# Altium schematic sheet 8.2 CC&CP.SchDoc: 6.6kW Daul OBC +11kW WPT
size A3; Date: 2022/11/13; Revision: V 1.0; SheetNumber: 10; SheetTotal: 14; PageSetup: Record=PageOptions|CenterHorizontal=True|CenterVertical=True|PrintScale=0.37|XCorrection=1.00|YCorrection=1.00|PrintKind=2|BorderSize=5000000|LeftOffset=0|BottomOffset=0|Orientation=2|PaperLength=1000|PaperWidth=1000|Scale=100|PaperSource=7|PrintQuality=-4|MediaType=1|DitherType=10|PaperKind=A4|PrintScaleMode=1; ImagePath: 0
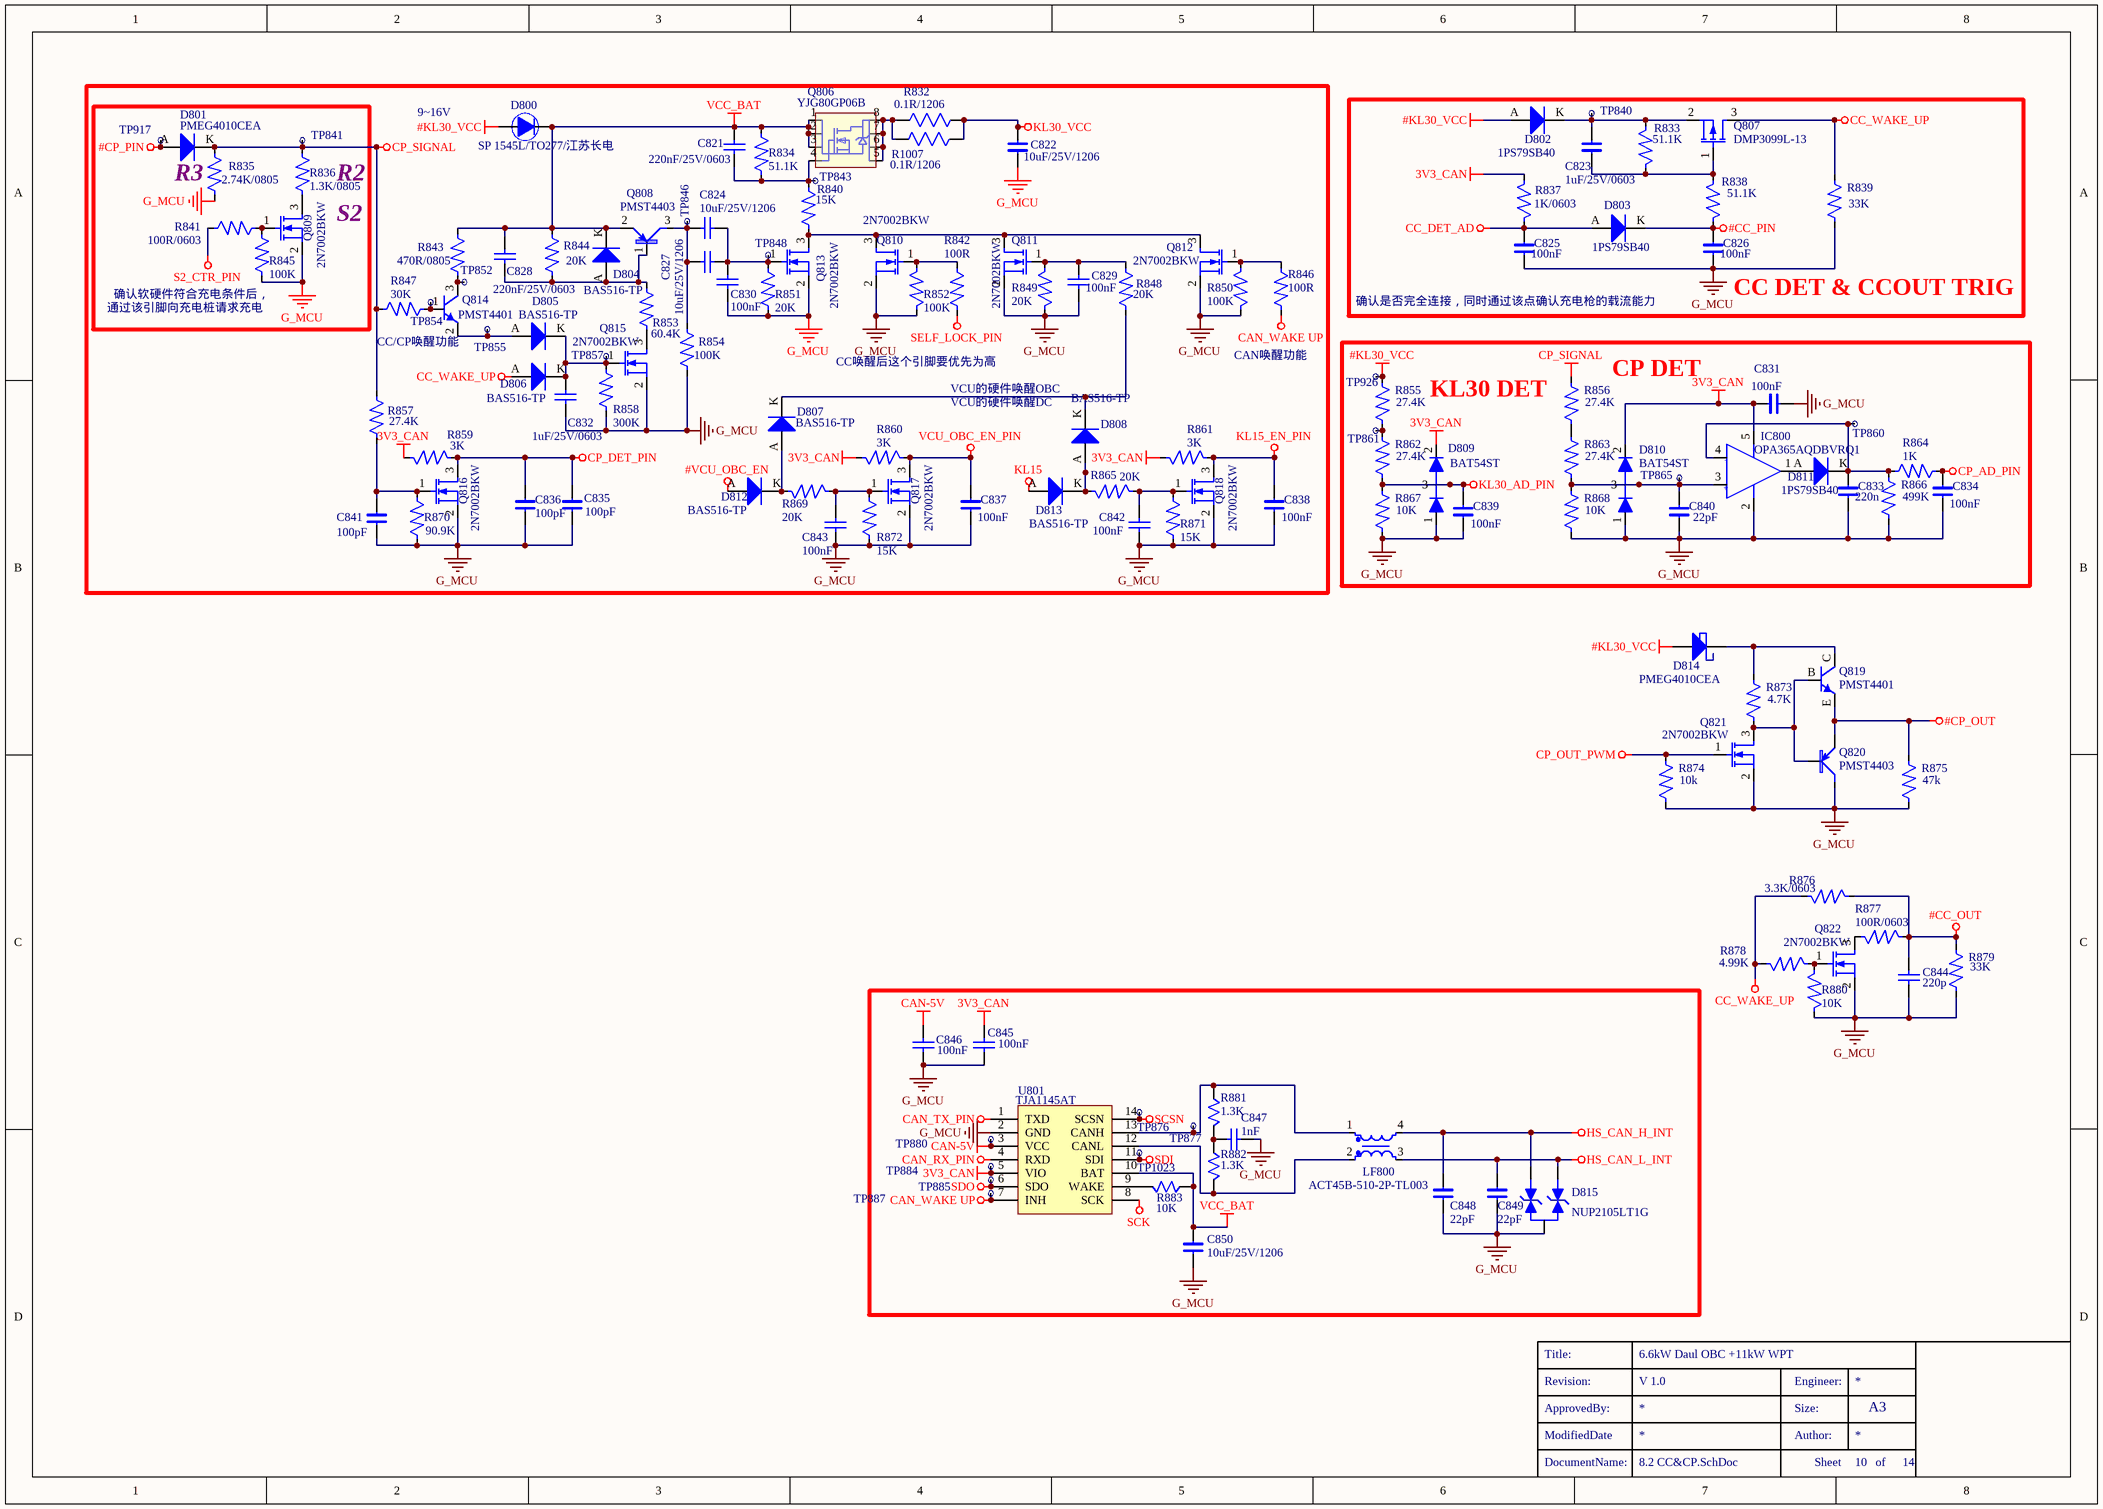
[diagram p0: 8.2 CC&CP.SchDoc]

## Parts
C821  220nF/25V/0603  [C0603]
C822  10uF/25V/1206  [C1206]
C823  1uF/25V/0603  [C0603]
C824  10uF/25V/1206  [C1206]
C825  100nF  [C0402]
C826  100nF  [C0603]
C827  10uF/25V/1206  [C1206]
C828  220nF/25V/0603  [C0603]
C829  100nF  [C0402]
C830  100nF  [C0402]
C831  100nF  [C0402]
C832  1uF/25V/0603  [C0603]
C833  220n  [C0402]
C834  100nF  [C0402]
C835  100pF  [C0402]
C836  100pF  [C0402]
C837  100nF  [C0402]
C838  100nF  [C0402]
C839  100nF  [C0402]
C840  22pF  [C0402]
C841  100pF  [C0402]
C842  100nF  [C0402]
C843  100nF  [C0402]
C844  220p  [C0402]
C845  100nF  [C0402]
C846  100nF  [C0402]
C847  1nF  [C0402]
C848  22pF  [C0402]
C849  22pF  [C0402]
C850  10uF/25V/1206  [C1206]
D800  SP 1545L/TO277/江苏长电  [D_TO277]
D801  PMEG4010CEA  [D_SOD323]
D802  1PS79SB40  [D_SOD-523_1222]
D803  1PS79SB40  [D_SOD-523_1222]
D804  BAS516-TP  [D_SOD-523_1222]
D805  BAS516-TP  [D_SOD-523_1222]
D806  BAS516-TP  [D_SOD-523_1222]
D807  BAS516-TP  [D_SOD-523_1222]
D808  BAS516-TP  [D_SOD-523_1222]
D809  BAT54ST  [D_SOT-523]
D810  BAT54ST  [D_SOT-523]
D811  1PS79SB40  [D_SOD-523_1222]
D812  BAS516-TP  [D_SOD-523_1222]
D813  BAS516-TP  [D_SOD-523_1222]
D814  PMEG4010CEA  [D_SOD323]
D815  NUP2105LT1G  [D_SOT-23]
IC800  OPA365AQDBVRQ1  [SOT23-5]
LF800  ACT45B-510-2P-TL003  [L_4.5*3.2*2.8]
Q806  YJG80GP06B  [Q_PG_TDSON_8]
Q807  DMP3099L-13  [Q_SOT23 - 2]
Q808  PMST4403  [Q_SOT323 - 2]
Q809  2N7002BKW  [Q_SOT323 - 2]
Q810  2N7002BKW  [Q_SOT323 - 2]
Q811  2N7002BKW  [Q_SOT323 - 2]
Q812  2N7002BKW  [Q_SOT323 - 2]
Q813  2N7002BKW  [Q_SOT323 - 2]
Q814  PMST4401  [Q_SOT323 - 2]
Q815  2N7002BKW  [Q_SOT323 - 2]
Q816  2N7002BKW  [Q_SOT323 - 2]
Q817  2N7002BKW  [Q_SOT323 - 2]
Q818  2N7002BKW  [Q_SOT323 - 2]
Q819  PMST4401  [Q_SOT323]
Q820  PMST4403  [SOT323 - 2]
Q821  2N7002BKW  [Q_SOT323 - 2]
Q822  2N7002BKW  [Q_SOT323 - 2]
R832  0.1R/1206  [R1206]
R833  51.1K  [R0402]
R834  51.1K  [R0402]
R835  2.74K/0805  [R0805]
R836  1.3K/0805  [R0805]
R837  1K/0603  [R0603]
R838  51.1K  [R0402]
R839  33K  [R0402]
R840  15K  [R0402]
R841  100R/0603  [R0603]
R842  100R  [R0402]
R843  470R/0805  [R0805]
R844  20K  [R0402]
R845  100K  [R0402]
R846  100R  [R0402]
R847  30K  [R0402]
R848  20K  [R0402]
R849  20K  [R0402]
R850  100K  [R0402]
R851  20K  [R0402]
R852  100K  [R0402]
R853  60.4K  [R0402]
R854  100K  [R0402]
R855  27.4K  [R0402]
R856  27.4K  [R0402]
R857  27.4K  [R0402]
R858  300K  [R0402]
R859  3K  [R0402]
R860  3K  [R0402]
R861  3K  [R0402]
R862  27.4K  [R0402]
R863  27.4K  [R0402]
R864  1K  [R0402]
R865  20K  [R0402]
R866  499K  [R0402]
R867  10K  [R0402]
R868  10K  [R0402]
R869  20K  [R0402]
R870  90.9K  [R0402]
R871  15K  [R0402]
R872  15K  [R0402]
R873  4.7K  [R0402]
R874  10k  [R0402]
R875  47k  [R0402]
R876  3.3K/0603  [R0603]
R877  100R/0603  [R0603]
R878  4.99K  [R0402]
R879  33K  [R0402]
R880  10K  [R0402]
R881  1.3K  [R0402]
R882  1.3K  [R0402]
R883  10K  [R0402]
R1007  0.1R/1206  [R1206]
TP840  测试点  [测试点]  (value not drawn)
TP841  测试点  [测试点]  (value not drawn)
TP843  测试点  [测试点]  (value not drawn)
TP846  测试点  [测试点]  (value not drawn)
TP848  测试点  [测试点]  (value not drawn)
TP852  测试点  [测试点]  (value not drawn)
TP854  测试点  [测试点]  (value not drawn)
TP855  测试点  [测试点]  (value not drawn)
TP857  测试点  [测试点]  (value not drawn)
TP860  测试点  [测试点]  (value not drawn)
TP861  测试点  [测试点]  (value not drawn)
TP865  测试点  [测试点]  (value not drawn)
TP876  测试点  [测试点]  (value not drawn)
TP877  测试点  [测试点]  (value not drawn)
TP880  测试点  [测试点]  (value not drawn)
TP884  测试点  [测试点]  (value not drawn)
TP885  测试点  [测试点]  (value not drawn)
TP887  测试点  [测试点]  (value not drawn)
TP917  测试点  [测试点]  (value not drawn)
TP926  测试点  [测试点]  (value not drawn)
TP1023  测试点  [测试点]  (value not drawn)
U801  TJA1145AT  [SOT108-1]

## Blocks framed on the sheet
CC DET & CCOUT TRIG: C823 C825 C826 D802 D803 Q807 R833 R837-R839 TP840

## Nets
3V3_CAN: C831.1 C845.1 D809.2(K) D810.2(K) IC800.5(VCC+) R837.2 R859.2 R860.2 R861.2 TP884.1 U801.5(VIO)
#CC_OUT: C844.1 R876.2 R877.1 R879.2
#CC_PIN: C826.1 D803.K R838.1
#CP_OUT: Q819.E Q820.2 R875.2
#CP_PIN: D801.A TP917.1
#KL30_VCC: D800.A D802.A D814.A R855.2 TP926.1
#VCU_OBC_EN: D812.A
CAN-5V: C846.2 TP880.1 U801.3(VCC)
CAN_RX_PIN: U801.4(RXD)
CAN_TX_PIN: U801.1(TXD)
CAN_WAKE UP: R846.2 TP887.1 U801.7(INH)
CC_DET_AD: C825.1 D803.A R837.1
CC_WAKE_UP: D806.A Q807.3(D) R839.2 R876.1 R878.2
CP_AD_PIN: C834.2 R864.1
CP_DET_PIN: C835.1 C836.1 Q816.3(D) R859.1
CP_OUT_PWM: Q821.1(G) R874.2
CP_SIGNAL: D801.K R835.2 R836.2 R847.2 R856.2 R857.2 TP841.1
G_MCU: C822.1 C825.2 C826.2 C829.2 C830.2 C831.2 C832.2 C833.2 C834.1 C835.2 C836.2 C837.2 C838.2 C839.2 C840.2 C841.2 C842.2 C843.2 C844.2 C845.2 C846.1 C847.1 C848.2 C849.2 C850.1 D809.1(A) D810.1(A) D815.3 IC800.2(VCC-) Q809.2(S) Q810.2(S) Q811.2(S) Q812.2(S) Q813.2(S) Q815.2(S) Q816.2(S) Q817.2(S) Q818.2(S) Q820.3 Q821.2(S) Q822.2(S) R835.1 R839.1 R845.1 R849.1 R850.1 R851.2 R852.1 R854.1 R858.1 R866.1 R867.1 R868.1 R870.1 R871.1 R872.1 R874.1 R875.1 R879.1 R880.1 U801.2(GND)
HS_CAN_H_INT: C848.1 D815.2 LF800.4
HS_CAN_L_INT: C849.1 D815.1 LF800.3
KL15: D813.A
KL15_EN_PIN: C838.1 Q818.3(D) R861.1
KL30_AD_PIN: C839.1 D809.3 R862.1 R867.2
KL30_VCC: C822.2 R832.1 R1007.1
S2_CTR_PIN: R841.2
SCK: U801.8(SCK)
SCSN: TP876.1 U801.14(SCSN)
SDI: TP1023.1 U801.11(SDI)
SDO: TP885.1 U801.6(SDO)
SELF_LOCK_PIN: R842.2
VCC_BAT: C821.1 C828.1 C850.2 D800.K D804.K Q806.1(S) Q806.2(S) Q806.3(S) Q808.2(E) R834.1 R843.2 R844.2 R883.2 U801.10(BAT)
VCU_OBC_EN_PIN: C837.1 Q817.3(D) R860.1
NetC821_2: C821.2 Q806.4(G) R834.2 R840.1 TP843.1
NetC823_1: C823.1 D802.K Q807.2(S) R833.1 TP840.1
NetC823_2: C823.2 Q807.1(G) R833.2 R838.2
NetC824_1: C824.1 C827.1 Q808.3(C) R854.2 TP846.1
NetC824_2: C824.2 C827.2 C830.1 Q813.1(G) R851.1 TP848.1
NetC828_2: C828.2 D804.A Q808.1(B) R844.1 R853.2
NetC829_1: C829.1 Q811.1(G) R848.1 R849.2
NetC832_1: C832.1 D805.K D806.K Q815.1(G) R858.2 TP857.1
NetC833_1: C833.1 D811.K IC800.4(-VIN) R864.2 R866.2 TP860.1
NetC840_1: C840.1 D810.3 IC800.3(+VIN) R863.1 R868.2 TP865.1
NetC841_1: C841.1 Q816.1(G) R857.1 R870.2
NetC842_1: C842.1 Q818.1(G) R865.1 R871.2
NetC843_1: C843.1 Q817.1(G) R869.1 R872.2
NetC847_2: C847.2 R881.1 R882.2
NetD805_A: D805.A Q814.2(E) TP855.1
NetD807_A: D807.A D812.K R869.2
NetD807_K: D807.K D808.K R848.2
NetD808_A: D808.A D813.K R865.2
NetD811_A: D811.A IC800.1(OUTPUT)
NetD814_K: D814.K Q819.C R873.2
NetLF800_1: LF800.1 R881.2 TP877.1 U801.13(CANH)
NetLF800_2: LF800.2 R882.1 U801.12(CANL)
NetQ806_5: Q806.5(D) Q806.6(D) Q806.7(D) Q806.8(D) R832.2 R1007.2
NetQ809_1: Q809.1(G) R841.1 R845.2
NetQ809_3: Q809.3(D) R836.1
NetQ810_1: Q810.1(G) R842.1 R852.2
NetQ810_3: Q810.3(D) Q811.3(D) Q812.3(D) Q813.3(D) R840.2
NetQ812_1: Q812.1(G) R846.1 R850.2
NetQ814_1: Q814.1(B) R847.1 TP854.1
NetQ814_3: Q814.3(C) R843.1 TP852.1
NetQ815_3: Q815.3(D) R853.1
NetQ819_B: Q819.B Q820.1 Q821.3(D) R873.1
NetQ822_1: Q822.1(G) R878.1 R880.2
NetQ822_3: Q822.3(D) R877.2
NetR855_1: R855.1 R862.2 TP861.1
NetR856_1: R856.1 R863.2
NetR883_1: R883.1 U801.9(WAKE)

## Notes on the sheet
- R3
- R2
- 9~16V
- S2
- 通过该引脚向充电桩请求充电
- 确认软硬件符合充电条件后，
- 确认是否完全连接，同时通过该点确认充电枪的载流能力
- CC/CP唤醒功能
- CC唤醒后这个引脚要优先为高
- CAN唤醒功能
- (near R856) CP DET
- VCU的硬件唤醒OBC
- VCU的硬件唤醒DC
- KL30 DET
- Revision:
- Title:
- Engineer:
- ModifiedDate
- ApprovedBy:
- Author:
- Size:
- A3
- DocumentName:
- Sheet
- of
- (in symbol TSV991) -; +

## Library data of the parts
C821 C824 C827-C830 C832 C842 C843 C845-C847 = Cap
C822 C823 C825 C826 C831 C833-C841 C848-C850 = CAP_GENERAL
C844 = Cap: Capacitor; Published: 8-Jun-2000; LatestRevisionDate: 17-Jul-2002; LatestRevisionNote: Re-released for DXP Platform.; PackageReference: RAD-0.3; Publisher: Altium Limited; PackageDescription: Radial Cap, Thru-Hole; 2 Leads; 0.3 in Pin Spacing; VALUE: 220p
D800 = DIODE_HIGH CURRENT_SMD: 800V 8A SMC LITEON; DIP/SMD: SMD; Top/Bottom: Top; VALUE: SP 1545L/TO277/江苏长电; Part Number: *
D801-D808 D811-D813 = DIODE_MICRO
D809 D810 = BAV99
D814 = Schottky  Diode
D815 = NUP2105
IC800 = TSV991
LF800 = LINE FILTER_RING CORE
Q806 = NMOS_POW_8: Infinion N_MOS 8PIN
Q807 = MOSFET_P CHANNEL
Q808 Q820 = PNP
Q809-Q813 Q815-Q818 Q821 = MOSFET_N CHANNEL
Q814 Q819 = NPN
Q822 = MOSFET_N CHANNEL: N MOS FET; DIP/SMD: SMD; Top/Bottom: Bottom; VALUE: 2N7002BKW; BQ-CCCP: BQ-CCCP
R832 R1007 = RES1206
R833-R875 = RESISTOR_0805
R876 R879 = RESISTOR_0805: RESISTOR
  R876: VALUE: 3.3K/0603
  R879: VALUE: 33K
R877 R878 R880 = RESISTOR_0805: RESISTOR; DIP/SMD: SMD; Top/Bottom: Bottom; BQ-CCCP: BQ-CCCP
  R877: VALUE: 100R/0603
  R878: VALUE: 4.99K
  R880: VALUE: 10K
R881-R883 = RES_GENERAL
U801 = TJA1145T